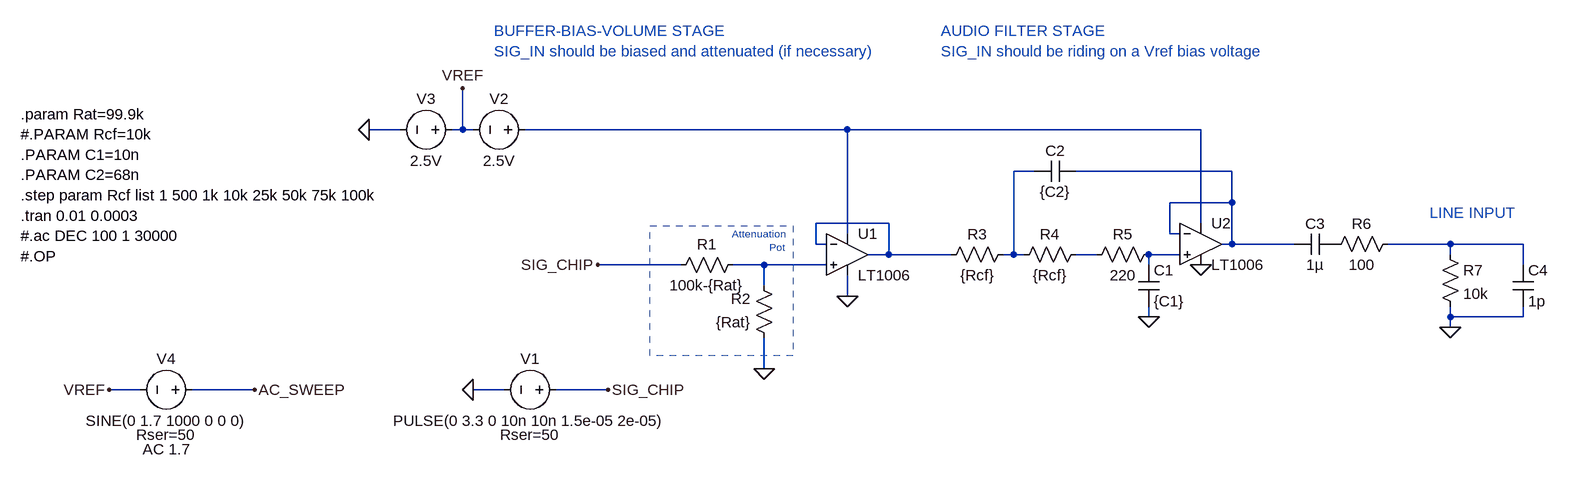
[diagram p0: schematic audio_output_stage.asc]
audio_output_stage.asc, the LTspice schematic file:
Version 4
SHEET 1 892 720
WIRE -944 64 -992 64
WIRE -848 64 -848 0
WIRE -848 64 -864 64
WIRE -832 64 -848 64
WIRE -256 64 -752 64
WIRE 288 64 -256 64
WIRE 32 128 0 128
WIRE 336 128 96 128
WIRE 336 176 336 128
WIRE 336 176 240 176
WIRE -192 208 -304 208
WIRE 288 208 288 64
WIRE -256 224 -256 64
WIRE 240 224 240 176
WIRE 256 224 240 224
WIRE -304 240 -304 208
WIRE -288 240 -304 240
WIRE 336 240 336 176
WIRE 336 240 320 240
WIRE 432 240 336 240
WIRE 672 240 576 240
WIRE 784 240 672 240
WIRE -192 256 -192 208
WIRE -192 256 -224 256
WIRE -96 256 -192 256
WIRE 0 256 0 128
WIRE 0 256 -16 256
WIRE 16 256 0 256
WIRE 128 256 96 256
WIRE 256 256 208 256
WIRE 672 256 672 240
WIRE -512 272 -640 272
WIRE -384 272 -432 272
WIRE -288 272 -384 272
WIRE 208 272 208 256
WIRE 784 272 784 240
WIRE -384 304 -384 272
WIRE -256 320 -256 288
WIRE 208 352 208 336
WIRE 672 352 672 336
WIRE 784 352 784 336
WIRE 784 352 672 352
WIRE 672 368 672 352
WIRE -384 432 -384 384
WIRE -1344 464 -1392 464
WIRE -1168 464 -1264 464
WIRE -784 464 -832 464
WIRE -624 464 -704 464
FLAG -624 464 SIG_CHIP
FLAG -832 464 0
FLAG -256 320 0
FLAG -992 64 0
FLAG -848 0 VREF
FLAG -640 272 SIG_CHIP
FLAG -384 432 0
FLAG 672 368 0
FLAG 288 272 0
FLAG 208 352 0
FLAG -1168 464 AC_SWEEP
FLAG -1392 464 VREF
SYMBOL voltage -688 464 R90
WINDOW 0 -32 56 VBottom 2
WINDOW 3 32 56 VTop 2
WINDOW 39 54 56 VTop 2
SYMATTR InstName V1
SYMATTR Value PULSE(0 3.3 0 10n 10n 1.5e-05 2e-05)
SYMATTR SpiceLine Rser=50
SYMBOL voltage -736 64 R90
WINDOW 0 -32 56 VBottom 2
WINDOW 3 32 56 VTop 2
SYMATTR InstName V2
SYMATTR Value 2.5V
SYMBOL voltage -848 64 R90
WINDOW 0 -32 56 VBottom 2
WINDOW 3 32 56 VTop 2
SYMATTR InstName V3
SYMATTR Value 2.5V
SYMBOL res -416 256 R90
WINDOW 0 0 56 VBottom 2
WINDOW 3 32 56 VTop 2
SYMATTR InstName R1
SYMATTR Value 100k-{Rat}
SYMBOL res -368 400 R180
WINDOW 0 36 76 Left 2
WINDOW 3 36 40 Left 2
SYMATTR InstName R2
SYMATTR Value {Rat}
SYMBOL res 592 224 R90
WINDOW 0 0 56 VBottom 2
WINDOW 3 32 56 VTop 2
SYMATTR InstName R6
SYMATTR Value 100
SYMBOL res 656 240 R0
SYMATTR InstName R7
SYMATTR Value 10k
SYMBOL cap 768 272 R0
SYMATTR InstName C4
SYMATTR Value 1p
SYMBOL res 0 240 R90
WINDOW 0 0 56 VBottom 2
WINDOW 3 32 56 VTop 2
SYMATTR InstName R3
SYMATTR Value {Rcf}
SYMBOL res 112 240 R90
WINDOW 0 0 56 VBottom 2
WINDOW 3 32 56 VTop 2
SYMATTR InstName R4
SYMATTR Value {Rcf}
SYMBOL cap 192 272 R0
SYMATTR InstName C1
SYMATTR Value {C1}
SYMATTR SpiceLine Rser=210.9m Lser=0 mfg="   ---" pn="   ---" type="   ---"
SYMBOL cap 96 112 R90
WINDOW 0 0 32 VBottom 2
WINDOW 3 32 32 VTop 2
SYMATTR InstName C2
SYMATTR Value {C2}
SYMATTR SpiceLine Rser=143.6m Lser=0 mfg="   ---" pn="   ---" type="   ---"
SYMBOL cap 496 224 R90
WINDOW 0 0 32 VBottom 2
WINDOW 3 32 32 VTop 2
SYMATTR InstName C3
SYMATTR Value 1µ
SYMATTR SpiceLine Rser=17.1m Lser=0 mfg="   ---" pn="   ---" type="   ---"
SYMBOL Opamps/LT1006 -256 192 R0
SYMATTR InstName U1
SYMBOL Opamps/LT1006 288 176 R0
SYMATTR InstName U2
SYMBOL voltage -1248 464 R90
WINDOW 0 -32 56 VBottom 2
WINDOW 3 32 56 VTop 2
WINDOW 39 54 56 VTop 2
WINDOW 123 76 56 VTop 2
SYMATTR InstName V4
SYMATTR Value SINE(0 1.7 1000 0 0 0)
SYMATTR SpiceLine Rser=50
SYMATTR Value2 AC 1.7
SYMBOL res 224 240 R90
WINDOW 0 0 56 VBottom 2
WINDOW 3 32 56 VTop 2
SYMATTR InstName R5
SYMATTR Value 220
TEXT -352 224 Right 1 ;Attenuation\nPot
TEXT -1528 40 Left 2 !.param Rat=99.9k\n#.PARAM Rcf=10k\n.PARAM C1=10n\n.PARAM C2=68n\n.step param Rcf list 1 500 1k 10k 25k 50k 75k 100k\n.tran 0.01 0.0003\n#.ac DEC 100 1 30000\n#.OP
TEXT -112 -88 Left 2 ;AUDIO FILTER STAGE\nSIG_IN should be riding on a Vref bias voltage
TEXT -800 -88 Left 2 ;BUFFER-BIAS-VOLUME STAGE\nSIG_IN should be biased and attenuated (if necessary)
TEXT 640 192 Left 2 ;LINE INPUT
RECTANGLE Normal -560 212 -340 412 3

The netlist it stands for:
* audio_output_stage.asc
V1 SIG_CHIP 0 PULSE(0 3.3 0 10n 10n 1.5e-05 2e-05) Rser=50
V2 N001 VREF 2.5V
V3 VREF 0 2.5V
R1 N008 SIG_CHIP 100k-{Rat}
R2 0 N008 {Rat}
R6 N005 P001 100
R7 N005 0 10k
C4 N005 0 1p
R3 N002 N004 {Rcf}
R4 N006 N002 {Rcf}
C1 N007 0 {C1} Rser=210.9m Lser=0 mfg="   ---" pn="   ---" type="   ---"
C2 N003 N002 {C2} Rser=143.6m Lser=0 mfg="   ---" pn="   ---" type="   ---"
C3 P001 N003 1µ Rser=17.1m Lser=0 mfg="   ---" pn="   ---" type="   ---"
XU1 N008 N004 N001 0 N004 LT1006  ; pins In+ In- V+ V- OUT
XU2 N007 N003 N001 0 N003 LT1006  ; pins In+ In- V+ V- OUT
V4 AC_SWEEP VREF SINE(0 1.7 1000 0 0 0) AC 1.7 Rser=50
R5 N007 N006 220
* Attenuation
* Pot
.param Rat=99.9k
#.PARAM Rcf=10k
.PARAM C1=10n
.PARAM C2=68n
.step param Rcf list 1 500 1k 10k 25k 50k 75k 100k
.tran 0.01 0.0003
#.ac DEC 100 1 30000
#.OP
* AUDIO FILTER STAGE
* SIG_IN should be riding on a Vref bias voltage
* BUFFER-BIAS-VOLUME STAGE
* SIG_IN should be biased and attenuated (if necessary)
* LINE INPUT
.lib LTC.lib
.backanno
.end